# Altium schematic sheet MAX6966_LedDriver.SchDoc
size A; Organization: Altium Limited; Address1: L3, 12a Rodborough Rd; Address2: Frenchs Forest; Address3: NSW; Address4: Australia 2086
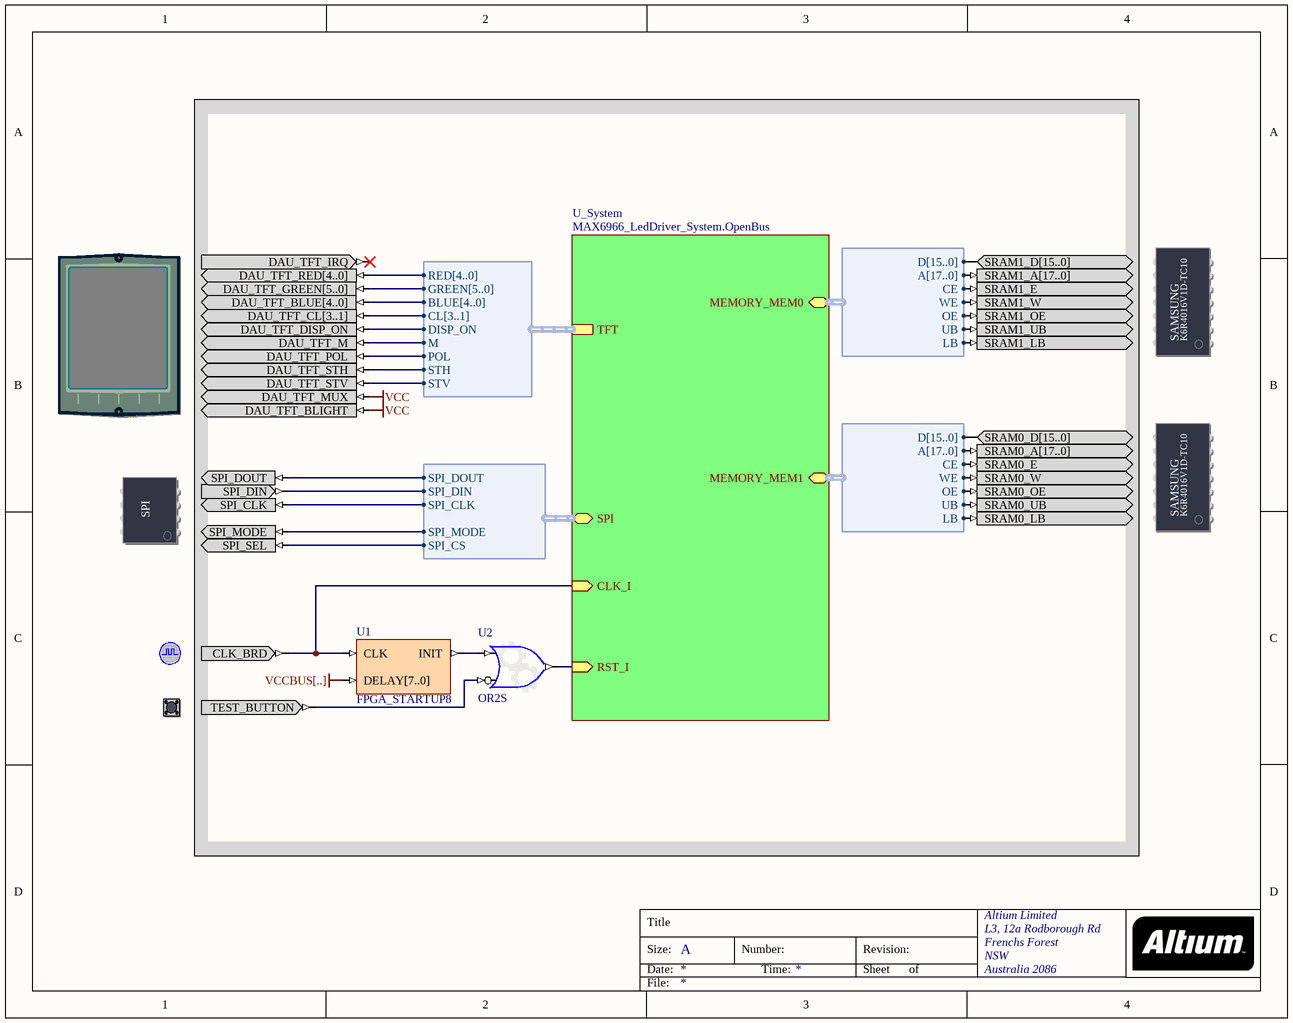
[diagram p0: MAX6966_LedDriver.SchDoc]

## Parts
(Parts that share a designator on the sheet are numbered #1, #2 ... from top to bottom, then left to right.)
?#1  TFT_LCD  (value not drawn)
?#2  SRAM_DAUGHTER1  (value not drawn)
?#3  SRAM_DAUGHTER0  (value not drawn)
?#4  SPI_BUS  (value not drawn)
?#5  CLOCK_BOARD  (value not drawn)
?#6  TEST_BUTTON  (value not drawn)
U1  FPGA_STARTUP8
U2  OR2S

## Sub-sheets
U_System = MAX6966_LedDriver_System.OpenBus: CLK_I (in), RST_I (in), TFT (harness VGA32_TFT), MEMORY_MEM0 (harness WB_MEM_CTRL_SRAM16_A18), MEMORY_MEM1 (harness WB_MEM_CTRL_SRAM16_A18), SPI (harness SPI_W_NB)

## Harnesses
VGA32_TFT: RED[4..0], GREEN[5..0], BLUE[4..0], CL[3..1], DISP_ON, M, POL, STH, STV
SPI_W_NB: SPI_DOUT, SPI_DIN, SPI_CLK, SPI_MODE, SPI_CS
WB_MEM_CTRL_SRAM16_A18: D[15..0], A[17..0], CE, WE, OE, UB, LB

## Nets
VCC: ?#1.DAU_TFT_BLIGHT ?#1.DAU_TFT_MUX
VCCBUS[..]: U1.DELAY[7..0]
Net?#1_DAU_TFT_BLUE[4..0]: ?#1.DAU_TFT_BLUE[4..0] ; sheet U_System/TFT.BLUE[4..0]
Net?#1_DAU_TFT_CL[3..1]: ?#1.DAU_TFT_CL[3..1] ; sheet U_System/TFT.CL[3..1]
Net?#1_DAU_TFT_DISP_ON: ?#1.DAU_TFT_DISP_ON ; sheet U_System/TFT.DISP_ON
Net?#1_DAU_TFT_GREEN[5..0]: ?#1.DAU_TFT_GREEN[5..0] ; sheet U_System/TFT.GREEN[5..0]
Net?#1_DAU_TFT_M: ?#1.DAU_TFT_M ; sheet U_System/TFT.M
Net?#1_DAU_TFT_POL: ?#1.DAU_TFT_POL ; sheet U_System/TFT.POL
Net?#1_DAU_TFT_RED[4..0]: ?#1.DAU_TFT_RED[4..0] ; sheet U_System/TFT.RED[4..0]
Net?#1_DAU_TFT_STH: ?#1.DAU_TFT_STH ; sheet U_System/TFT.STH
Net?#1_DAU_TFT_STV: ?#1.DAU_TFT_STV ; sheet U_System/TFT.STV
Net?#2_SRAM1_A[17..0]: ?#2.SRAM1_A[17..0] ; sheet U_System/MEMORY_MEM0.A[17..0]
Net?#2_SRAM1_D[15..0]: ?#2.SRAM1_D[15..0] ; sheet U_System/MEMORY_MEM0.D[15..0]
Net?#2_SRAM1_E: ?#2.SRAM1_E ; sheet U_System/MEMORY_MEM0.CE
Net?#2_SRAM1_LB: ?#2.SRAM1_LB ; sheet U_System/MEMORY_MEM0.LB
Net?#2_SRAM1_OE: ?#2.SRAM1_OE ; sheet U_System/MEMORY_MEM0.OE
Net?#2_SRAM1_UB: ?#2.SRAM1_UB ; sheet U_System/MEMORY_MEM0.UB
Net?#2_SRAM1_W: ?#2.SRAM1_W ; sheet U_System/MEMORY_MEM0.WE
Net?#3_SRAM0_A[17..0]: ?#3.SRAM0_A[17..0] ; sheet U_System/MEMORY_MEM1.A[17..0]
Net?#3_SRAM0_D[15..0]: ?#3.SRAM0_D[15..0] ; sheet U_System/MEMORY_MEM1.D[15..0]
Net?#3_SRAM0_E: ?#3.SRAM0_E ; sheet U_System/MEMORY_MEM1.CE
Net?#3_SRAM0_LB: ?#3.SRAM0_LB ; sheet U_System/MEMORY_MEM1.LB
Net?#3_SRAM0_OE: ?#3.SRAM0_OE ; sheet U_System/MEMORY_MEM1.OE
Net?#3_SRAM0_UB: ?#3.SRAM0_UB ; sheet U_System/MEMORY_MEM1.UB
Net?#3_SRAM0_W: ?#3.SRAM0_W ; sheet U_System/MEMORY_MEM1.WE
Net?#4_SPI_CLK: ?#4.SPI_CLK ; sheet U_System/SPI.SPI_CLK
Net?#4_SPI_DIN: ?#4.SPI_DIN ; sheet U_System/SPI.SPI_DIN
Net?#4_SPI_DOUT: ?#4.SPI_DOUT ; sheet U_System/SPI.SPI_DOUT
Net?#4_SPI_MODE: ?#4.SPI_MODE ; sheet U_System/SPI.SPI_MODE
Net?#4_SPI_SEL: ?#4.SPI_SEL ; sheet U_System/SPI.SPI_CS
Net?#5_CLK_BRD: ?#5.CLK_BRD U1.CLK ; sheet U_System/CLK_I
Net?#6_TEST_BUTTON: ?#6.TEST_BUTTON U2.I1
NetU1_INIT: U1.INIT U2.I0
NetU2_O: U2.O ; sheet U_System/RST_I

Not connected (* = marked no-connect by the designer): ?#1 DAU_TFT_IRQ*

## Notes on the sheet
- Title
- Size:
- Date:
- A
- Number:
- Time:
- Revision:
- Sheet
- of
- File:
- (in symbol SPI_BUS) SPI
- (in symbol SRAM_DAUGHTER0) SAMSUNG; K6R4016V1D-TC10
- (in symbol SRAM_DAUGHTER1) SAMSUNG; K6R4016V1D-TC10

## Library data of the parts
?#1 = TFT_LCD: TFT LCD Panel; PortComponent: True; Published: 22-Jan-2007; Publisher: Altium Limited; HelpURL: TR0143 Technical Reference Manual for Altium's Desktop NanoBoard NB2DSK01.pdf#page=50
?#2 = SRAM_DAUGHTER1: Free Static RAM - Daughterboard; PortComponent: True; Published: 14-May-2007; Publisher: Altium Limited; HelpURL: TR0149 Technical Reference for Altium's Xilinx Spartan-3 Daughter Board DB30.pdf#page=16
?#3 = SRAM_DAUGHTER0: Free Static RAM - Daughterboard; PortComponent: True; Published: 14-May-2007; Publisher: Altium Limited; HelpURL: TR0149 Technical Reference for Altium's Xilinx Spartan-3 Daughter Board DB30.pdf#page=16
?#4 = SPI_BUS: Generic SPI Bus; PortComponent: True; Published: 22-Jan-2007; Publisher: Altium Limited; HelpURL: TR0143 Technical Reference Manual for Altium's Desktop NanoBoard NB2DSK01.pdf#page=55
?#5 = CLOCK_BOARD: Global System Clock Supply; PortComponent: True; Published: 19-Nov-2003; Publisher: Altium Limited; HelpURL: TR0143 Technical Reference Manual for Altium's Desktop NanoBoard NB2DSK01.pdf#page=41; UseInDSF: True
?#6 = TEST_BUTTON: Test / Reset Button; PortComponent: True; Published: 19-Nov-2003; Publisher: Altium Limited; HelpURL: TR0143 Technical Reference Manual for Altium's Desktop NanoBoard NB2DSK01.pdf#page=53
U1 = FPGA_STARTUP8: FPGA Startup With 8 Bit Delay; Published: 9-Dec-2004; Publisher: Altium Limited; HelpURL: CR0119 FPGA_STARTUPx Powerup Delay Unit.pdf; LastRevisionNo: 1.00.00; ComponentLink1Description: Core &Resource Usage; ComponentLink1URL: CR0139 FPGA Peripheral Resource Usage.pdf#page=11
U2 = GATE: Configurable Generic Gate; ConfiguratorName: GENERIC_GATE; ConfigurationParameters: {}Version[1.0]{}GateKind[OR]{}BusInput[False]{}GateInputType[Bit]{}GateOutputOption[Normal]{}BusWidth[8]{}RegisterOutputs[False]{}NegativeClockEdge[False]{}InputCount[2]{}InputInvert0[False]{}InputInvert1[True]{}; LastRevisionNo: 1.00.00; Published: 3-Sep-2008; Publisher: Altium Limited